# Altium schematic sheet [02] TOP.SchDoc: Top schematic
size A4; Engineer: M. Folejewski; DocumentNumber: 2; SheetNumber: 2; SheetTotal: 5; PageSize: A4; Designators: 1-99
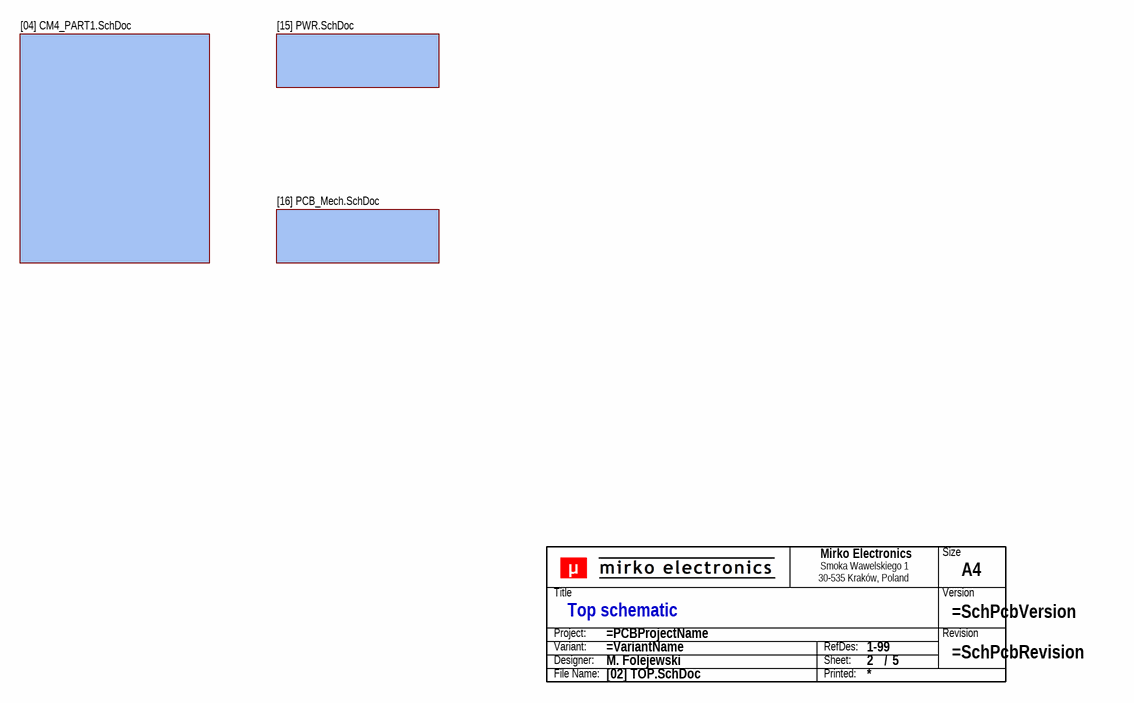
[diagram p0: [02] TOP.SchDoc]

## Parts
TB?  Title block  (value not drawn)  (graphical)

## Sub-sheets
BLK1 = [04] CM4_PART1.SchDoc: no entries
BLK4 = [16] PCB_Mech.SchDoc: no entries
BLK4 = [15] PWR.SchDoc: no entries

## Notes on the sheet
- (in symbol SCH_TITLE_BLOCK_V1) Mirko Electronics; Size; Smoka Wawelskiego 1; 30-535 Kraków, Poland; Title; Version; Project:; Revision; Variant:; RefDes:; Designer:; Sheet:; /; File Name:; Printed:

## Library data of the parts
TB? = SCH_TITLE_BLOCK_V1: Component Type: Title block; Manufacturer: -; Mounting Type: Non component; MPN: -; Operating Temperature: -; Package: -; Specification: Title block; Value: Title block; Replacement: -; System: ?